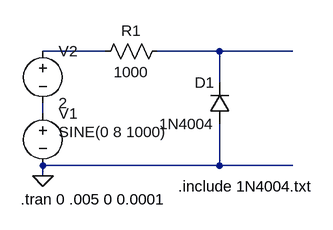
[diagram p0: schematic Lab4Pre1.asc]
Lab4Pre1.asc, the LTspice schematic file:
Version 4
SHEET 1 880 680
WIRE 144 64 48 64
WIRE 320 64 224 64
WIRE 432 64 320 64
WIRE 320 112 320 64
WIRE 48 160 48 144
WIRE 320 240 320 176
WIRE 320 240 48 240
WIRE 432 240 320 240
WIRE 48 256 48 240
FLAG 48 256 0
SYMBOL voltage 48 144 R0
WINDOW 3 24 44 Left 2
WINDOW 123 0 0 Left 2
WINDOW 39 0 0 Left 2
SYMATTR InstName V1
SYMATTR Value SINE(0 8 1000)
SYMBOL res 240 48 R90
WINDOW 0 0 56 VBottom 2
WINDOW 3 32 56 VTop 2
SYMATTR InstName R1
SYMATTR Value 1000
SYMBOL diode 336 176 R180
WINDOW 0 24 64 Left 2
WINDOW 3 24 0 Left 2
SYMATTR InstName D1
SYMATTR Value 1N4004
SYMBOL voltage 48 48 R0
WINDOW 123 0 0 Left 2
WINDOW 39 0 0 Left 2
SYMATTR InstName V2
SYMATTR Value 2
TEXT 256 272 Left 2 !.include 1N4004.txt
TEXT 14 292 Left 2 !.tran 0 .005 0 0.0001

The netlist it stands for:
* Lab4Pre1.asc
V1 N003 0 SINE(0 8 1000)
R1 N002 N001 1000
D1 0 N002 1N4004
V2 N001 N003 2
.model D D
.lib standard.dio
.include 1N4004.txt
.tran 0 .005 0 0.0001
.backanno
.end